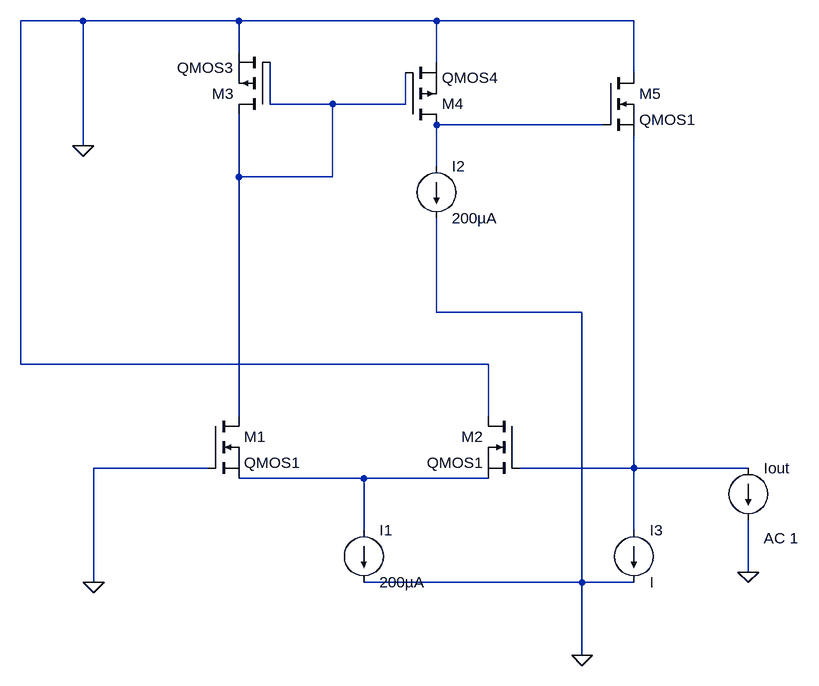
[diagram p0: schematic Assignment3_Rout.asc]
Assignment3_Rout.asc, the LTspice schematic file:
Version 4
SHEET 1 1024 708
WIRE -80 -544 -176 -544
WIRE 160 -544 -80 -544
WIRE 464 -544 160 -544
WIRE 768 -544 464 -544
WIRE 160 -496 160 -544
WIRE 464 -480 464 -544
WIRE 768 -464 768 -544
WIRE 208 -416 208 -480
WIRE 304 -416 208 -416
WIRE 416 -416 416 -464
WIRE 416 -416 304 -416
WIRE 720 -384 464 -384
WIRE -80 -352 -80 -544
WIRE 464 -320 464 -384
WIRE 160 -304 160 -400
WIRE 304 -304 304 -416
WIRE 304 -304 160 -304
WIRE 464 -96 464 -240
WIRE 688 -96 464 -96
WIRE -176 -16 -176 -544
WIRE 544 -16 -176 -16
WIRE 160 64 160 -304
WIRE 544 64 544 -16
WIRE 112 144 -64 144
WIRE 768 144 768 -368
WIRE 768 144 592 144
WIRE 944 144 768 144
WIRE 352 160 160 160
WIRE 544 160 352 160
WIRE 352 240 352 160
WIRE 768 240 768 144
WIRE 944 304 944 224
WIRE -64 320 -64 144
WIRE 688 320 688 -96
WIRE 688 320 352 320
WIRE 768 320 688 320
WIRE 688 432 688 320
FLAG -64 320 0
FLAG 688 432 0
FLAG -80 -352 0
FLAG 944 304 0
SYMBOL nmos 112 64 R0
SYMATTR InstName M1
SYMATTR Value QMOS1
SYMBOL nmos 592 64 M0
SYMATTR InstName M2
SYMATTR Value QMOS1
SYMBOL nmos 720 -464 R0
SYMATTR InstName M5
SYMATTR Value QMOS1
SYMBOL current 352 240 R0
SYMATTR InstName I1
SYMATTR Value 200µA
SYMBOL current 768 240 R0
SYMATTR InstName I3
SYMBOL current 464 -320 R0
SYMATTR InstName I2
SYMATTR Value 200µA
SYMBOL pmos 416 -384 M180
SYMATTR InstName M4
SYMATTR Value QMOS4
SYMBOL pmos 208 -400 R180
SYMATTR InstName M3
SYMATTR Value QMOS3
SYMBOL current 944 144 R0
WINDOW 123 24 108 Left 2
WINDOW 39 0 0 Left 2
SYMATTR InstName Iout
SYMATTR Value ""
SYMATTR Value2 AC 1

The netlist it stands for:
* Assignment3_Rout.asc
M1 N001 0 N004 N004 QMOS1
M2 0 N003 N004 N004 QMOS1
M5 0 N002 N003 N003 QMOS1
I1 N004 0 200µA
I3 N003 0 I
I2 N002 0 200µA
M4 N002 N001 0 0 QMOS4
M3 N001 N001 0 0 QMOS3
Iout N003 0 AC 1
.model NMOS NMOS
.model PMOS PMOS
.lib standard.mos
.backanno
.end